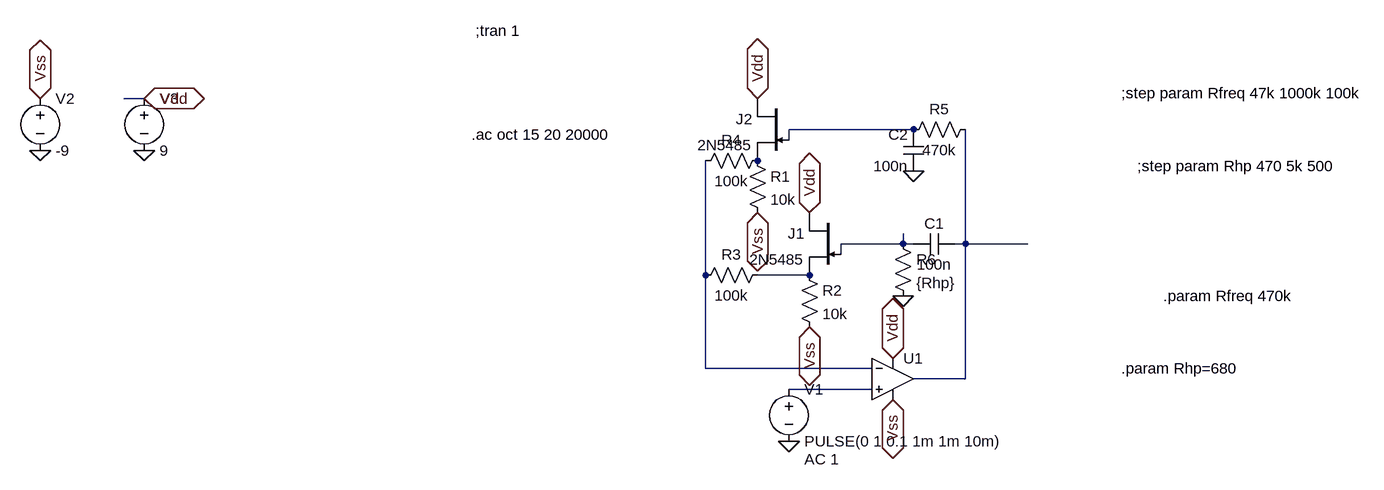
[diagram p0: schematic improvedDrumOsc.asc]
improvedDrumOsc.asc, the LTspice schematic file:
Version 4
SHEET 1 960 680
WIRE -976 -192 -1008 -192
WIRE 208 -144 16 -144
WIRE 16 -128 16 -144
WIRE 192 32 192 16
WIRE 192 32 96 32
WIRE 208 32 192 32
WIRE 288 32 288 -144
WIRE 288 32 272 32
WIRE 384 32 288 32
WIRE 96 48 96 32
WIRE -112 80 -112 -96
WIRE 48 80 -32 80
WIRE -112 224 -112 80
WIRE 144 224 -112 224
WIRE 288 240 288 32
WIRE 288 240 208 240
WIRE 144 256 16 256
FLAG 176 272 Vss
IOPIN 176 272 BiDir
FLAG 176 208 Vdd
IOPIN 176 208 BiDir
FLAG 16 336 0
FLAG 48 160 Vss
IOPIN 48 160 BiDir
FLAG -32 -16 Vss
IOPIN -32 -16 BiDir
FLAG 48 -16 Vdd
IOPIN 48 -16 BiDir
FLAG -32 -192 Vdd
IOPIN -32 -192 BiDir
FLAG 192 112 0
FLAG 208 -80 0
FLAG -1136 -112 0
FLAG -976 -112 0
FLAG -976 -192 Vdd
IOPIN -976 -192 BiDir
FLAG -1136 -192 Vss
IOPIN -1136 -192 BiDir
SYMBOL Opamps\\UniversalOpamp2 176 240 R0
SYMATTR InstName U1
SYMBOL res -48 -112 R0
SYMATTR InstName R1
SYMATTR Value 10k
SYMBOL res 32 64 R0
SYMATTR InstName R2
SYMATTR Value 10k
SYMBOL res -16 64 R90
WINDOW 0 0 56 VBottom 2
WINDOW 3 32 56 VTop 2
SYMATTR InstName R3
SYMATTR Value 100k
SYMBOL res -16 -112 R90
WINDOW 0 0 56 VBottom 2
WINDOW 3 32 56 VTop 2
SYMATTR InstName R4
SYMATTR Value 100k
SYMBOL voltage 16 240 R0
WINDOW 123 24 124 Left 2
WINDOW 39 0 0 Left 0
SYMATTR InstName V1
SYMATTR Value PULSE(0 1 0.1 1m 1m 10m)
SYMATTR Value2 AC 1
SYMBOL res 304 -160 R90
WINDOW 0 0 56 VBottom 2
WINDOW 3 32 56 VTop 2
SYMATTR InstName R5
SYMATTR Value 470k
SYMBOL cap 272 16 R90
WINDOW 0 0 32 VBottom 2
WINDOW 3 32 32 VTop 2
SYMATTR InstName C1
SYMATTR Value 100n
SYMBOL cap 224 -80 R180
WINDOW 0 24 56 Left 2
WINDOW 3 24 8 Left 2
SYMATTR InstName C2
SYMATTR Value 100n
SYMBOL res 176 16 R0
SYMATTR InstName R6
SYMATTR Value {Rhp}
SYMBOL voltage -1136 -208 R0
WINDOW 123 0 0 Left 0
WINDOW 39 0 0 Left 0
SYMATTR InstName V2
SYMATTR Value -9
SYMBOL voltage -976 -208 R0
WINDOW 123 0 0 Left 0
WINDOW 39 0 0 Left 0
SYMATTR InstName V3
SYMATTR Value 9
SYMBOL njf 96 -16 M0
SYMATTR InstName J1
SYMATTR Value 2N5485
SYMBOL njf 16 -192 M0
SYMATTR InstName J2
SYMATTR Value 2N5485
TEXT -466 -296 Left 2 !;tran 1
TEXT 528 -200 Left 2 !;step param Rfreq 47k 1000k 100k
TEXT 552 -88 Left 2 !;step param Rhp 470 5k 500
TEXT 592 112 Left 2 !.param Rfreq 470k
TEXT 528 224 Left 2 !.param Rhp=680
TEXT -472 -136 Left 2 !.ac oct 15 20 20000

The netlist it stands for:
* improvedDrumOsc.asc
XU1 N006 N004 Vdd Vss N003 level.2 Avol=1Meg GBW=10Meg Slew=10Meg ilimit=25m rail=0 Vos=0 phimargin=45 en=0 enk=0 in=0 ink=0 Rin=500Meg  ; pins IN+ IN- V+ V- OUT
R1 P001 Vss 10k
R2 N005 Vss 10k
R3 N005 N004 100k
R4 P001 N004 100k
V1 N006 0 PULSE(0 1 0.1 1m 1m 10m) AC 1
R5 N003 N001 470k
C1 N003 N002 100n
C2 0 N001 100n
R6 N002 0 {Rhp}
V2 Vss 0 -9
V3 Vdd 0 9
J1 Vdd N002 N005 2N5485
J2 Vdd N001 P001 2N5485
.model NJF NJF
.model PJF PJF
.lib standard.jft
;tran 1
;step param Rfreq 47k 1000k 100k
;step param Rhp 470 5k 500
.param Rfreq 470k
.param Rhp=680
.ac oct 15 20 20000
.lib UniversalOpamps2.sub
.backanno
.end